# EAGLE design robot (EAGLE 9.1.3)
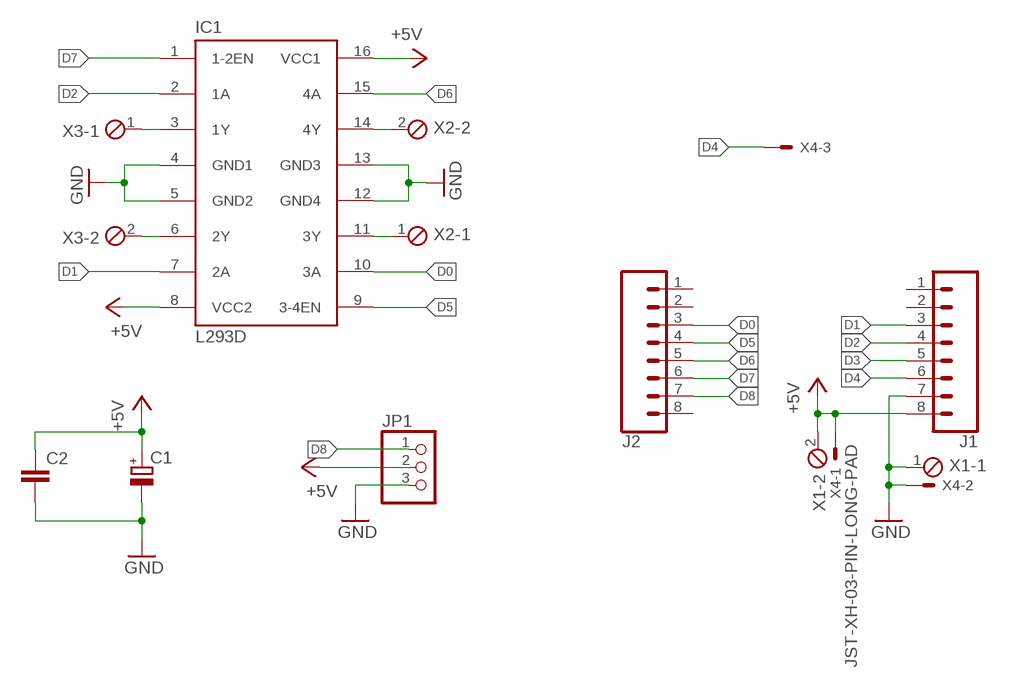
[diagram p0: schematic, sheet 1]

## Parts
C1  CPOL-EUE2.5-7  [E2,5-7]
C2  C-EUC0805K  [C0805K]
IC1  L293D  [DIL16]
J1  CONN_08"  [1X08]
J2  CONN_08"  [1X08]
JP1  PINHD-1X3  [1X03]
X1  MPT2  [2POL254]
X2  MPT2  [2POL254]
X3  MPT2  [2POL254]
X4  JST-XH-03-PIN-LONG-PAD  [JST-XH-03-PACKAGE-LONG-PAD]

## Nets
+5V: C1.+ C2.1 IC1.8(VCC2) IC1.16(VCC1) J1.8 JP1.2 X1.2 X4.1
D0: IC1.10(3A) J2.3
D1: IC1.7(2A) J1.3
D2: IC1.2(1A) J1.4
D3: J1.5
D4: J1.6 X4.3
D5: IC1.9(3-4EN) J2.4
D6: IC1.15(4A) J2.5
D7: IC1.1(1-2EN) J2.6
D8: J2.7 JP1.1
GND: C1.- C2.2 IC1.4(GND1) IC1.5(GND2) IC1.12(GND4) IC1.13(GND3) J1.7 JP1.3 X1.1 X4.2
N$1: IC1.3(1Y) X3.1
N$2: IC1.6(2Y) X3.2
N$3: IC1.11(3Y) X2.1
N$4: IC1.14(4Y) X2.2
Unconnected: J1.1 J1.2 J2.1 J2.2 J2.8

## Library data of the parts
C1 = rcl:CPOL-EU: POLARIZED CAPACITOR, European symbol
C2 = rcl:C-EU: CAPACITOR, European symbol
IC1 = st-microelectronics:L293D: PUSH-PULL 4 CHANNEL DRIVER; MPN: L293D; OC_FARNELL: 9589619; OC_NEWARK: 56P8249
J1 J2 = SparkFun-Connectors:CONN_08: Multi connection point. Often used as Generic Header-pin footprint for 0.1 inch spaced/style header connections On any of the 0.1 inch spaced packages, you can populate with these: Break Away Headers - Straight <https://www.sparkfun.com/products/116> (PRT-00116) Break Away Male Headers - Right Angle <https://www.sparkfun.com/products/553> (PRT-00553) Female Headers <https://www.sparkfun.com/products/115> (PRT-00115) Break Away Headers - Machine Pin <https://www.sparkfun.com/products/117> (PRT-00117) Break Away Female Headers - Swiss Machine Pin <https://www.sparkfun.com/products/743> (PRT-00743) Arduino Stackable Header - 8 Pin <https://www.sparkfun.com/products/9279> (PRT-09279) For SCREWTERMINALS and SPRING TERMINALS visit here: Screw Terimnals on SparkFun.com <https://www.sparkfun.com/search/results?term=Screw+Terminals> (5mm/3.5mm/2.54mm spacing) This device is also useful as a general connection point to wire up your design to another part of your project. Our various solder wires solder well into these plated through hole pads. Hook-Up Wire - Assortment (Stranded, 22 AWG) <https://www.sparkfun.com/products/11375> (PRT-11375) Hook-Up Wire - Assortment (Solid Core, 22 AWG) <https://www.sparkfun.com/products/11367> (PRT-11367) View the entire wire category on our website here <https://www.sparkfun.com/categories/141> Special notes: Molex polarized connector foot print use with SKU : PRT-08231 with associated crimp pins and housings. 1MM SMD Version SKU: PRT-10208 NOTES ON THE VARIANTS LOCK and LOCK_LONGPADS... This footprint was designed to help hold the alignment of a through-hole component (i.e. 6-pin header) while soldering it into place. You may notice that each hole has been shifted either up or down by 0.005 of an inch from it's more standard position (which is a perfectly straight line). This slight alteration caused the pins (the squares in the middle) to touch the edges of the holes. Because they are alternating, it causes a "brace" to hold the component in place. 0.005 has proven to be the perfect amount of "off-center" position when using our standard breakaway headers. Although looks a little odd when you look at the bare footprint, once you have a header in there, the alteration is very hard to notice. Also,if you push a header all the way into place, it is covered up entirely on the bottom side.; PROD_ID: CONN-08438
JP1 = pinhead:PINHD-1X3: PIN HEADER
X1-X3 = con-phoenix-254:MPT2: PHOENIX CONNECTOR; OC_FARNELL: unknown; OC_NEWARK: unknown
X4 = Rembrandt Electronics - JST XH Connectors v1-0:JST-XH-03-PIN: JST XH Connector 2 Pin Wire to board connector. Pitch: 2,54 mm, (0.100") Number of pins: 3 Created by Rembrandt Electronics www.rembrandtelectronics.com

## Board
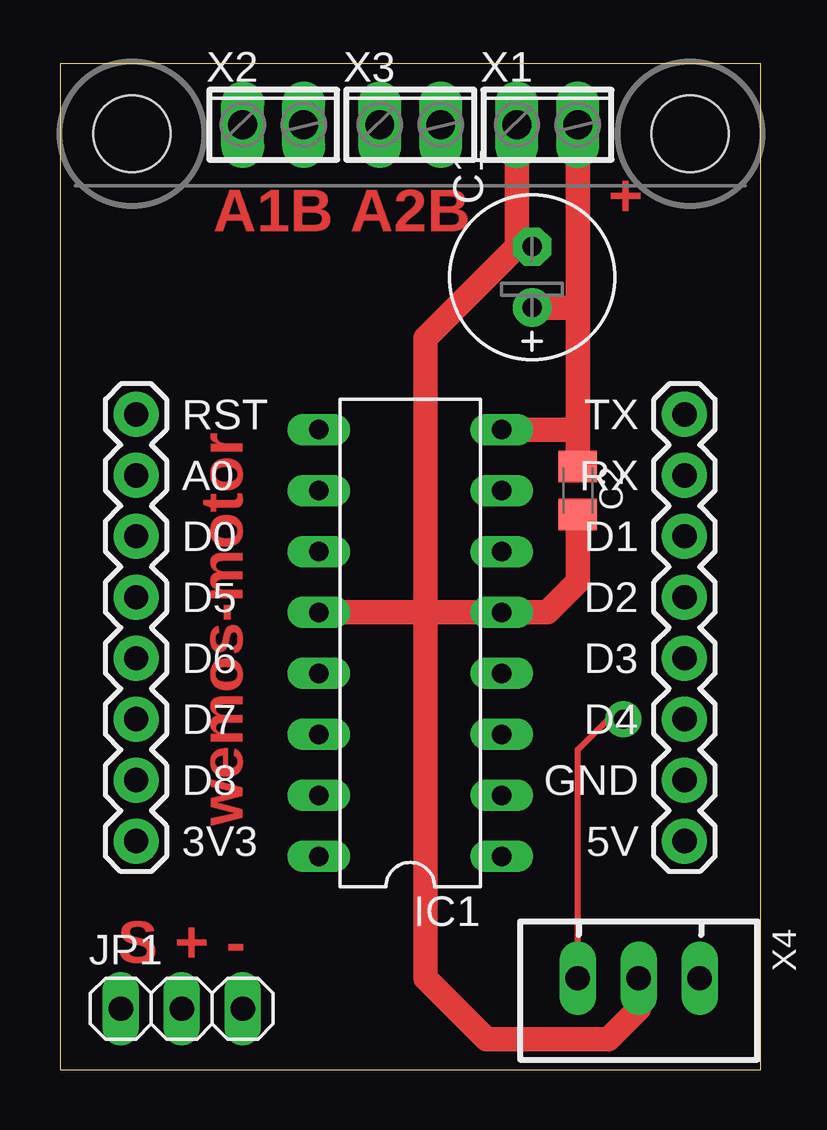
[diagram p1: board, top side]
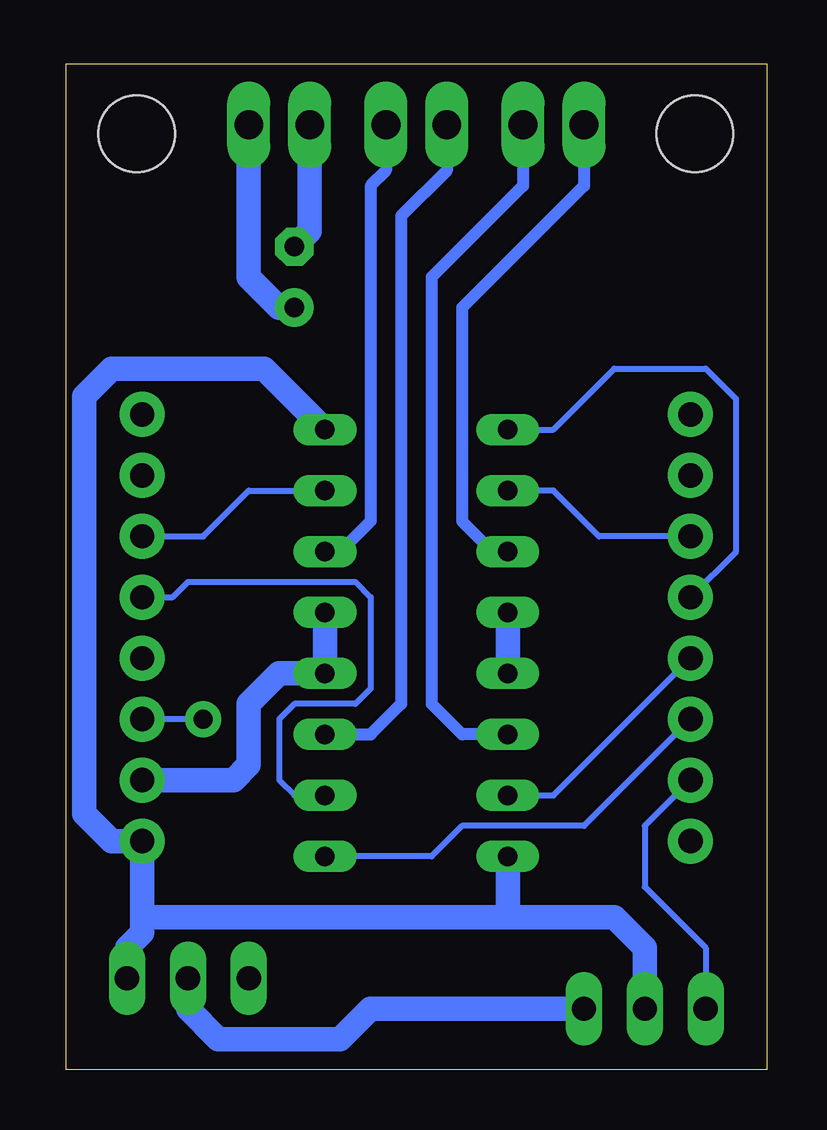
[diagram p2: board, bottom side, seen from below]

Size 29.21 x 41.91 mm. Coordinates in mm from the lower left corner, seen from the top.
Outline: 0,0 29.21,0 29.21,41.91 0,41.91 0,0
Copper layers (1*16): Top 0.035mm / dielectric 1.5mm / Bottom 0.035mm
Design rules "SeeedStudio_2layer_DRU_no_angle_20140221 *": minimum track width 10mil, minimum drill 0.5mm, track to track 10mil, track to pad 10mil, pad to pad 10mil, via to via 10mil, smd to smd 0mil, copper to edge 10mil, drill to drill 10mil, minimum pad ring 10mil, minimum via ring 6mil, stop-mask expansion 2mil, vias tented up to drill 100mil, thermal gap 10mil
Holes 3.2 mm at 3,39 26.27,39

### Footprints (pad centres in the part's own frame; a part is rotated, then mirrored left to right if it is on the bottom)
E2,5-7 = drill 0.813 pad 1.6: + -1.27,0 | drill 0.813 pad 1.6 octagon: - 1.27,0
C0805K = smd 1.3 x 1.6: 1 -1,0; 2 1,0
DIL16 = drill 0.813 long: 1 -8.89,-3.81; 2 -6.35,-3.81; 3 -3.81,-3.81; 4 -1.27,-3.81; 5 1.27,-3.81; 6 3.81,-3.81; 7 6.35,-3.81; 8 8.89,-3.81; 9 8.89,3.81; 10 6.35,3.81; 11 3.81,3.81; 12 1.27,3.81; 13 -1.27,3.81; 14 -3.81,3.81; 15 -6.35,3.81; 16 -8.89,3.81
1X08 = drill 1.016 pad 1.88: 1 0,0; 2 2.54,0; 3 5.08,0; 4 7.62,0; 5 10.16,0; 6 12.7,0; 7 15.24,0; 8 17.78,0
1X03 = drill 1.016 long: 1 -2.54,0; 2 0,0; 3 2.54,0
2POL254 = drill 1.2 long: 1 -1.27,0; 2 1.27,0
JST-XH-03-PACKAGE-LONG-PAD = drill 1.016 long: 1 -2.54,0; 2 0,0; 3 2.54,0

### Placement (x,y rotation side)
C1  19.68,33.02 90 top
C2  21.59,24.13 270 top
IC1  14.61,17.78 90 top
J1  26.04,27.3 270 top
J2  3.17,27.3 270 top
JP1  5.08,2.54 0 top
X1  20.32,39.37 0 top
X2  8.89,39.37 0 top
X3  14.61,39.37 0 top
X4  24.13,3.81 180 top

### Tracks (layer width: path | path; a pad name or v marks a point on that pad's centre or on a via)
+5V
  Top 1.016: IC1.8 21.59,26.67 | 21.59,26.67 21.59,31.75 | 21.59,31.75 X1.2 | C1.+ 21.59,31.75 | C2.1 21.59,26.67
  Bottom 1.016: IC1.8 20.95,29.21 27.3,29.21 28.45,28.07 28.45,10.67 27.3,9.53 J1.8 26.04,6.35 | IC1.16 10.79,6.99 10.79,6.35 | X4.1 26.67,5.08 26.04,5.71 26.04,6.35 | 10.79,6.35 26.04,6.35 | 10.79,6.35 6.35,6.35 5.08,5.08 JP1.2 | X1.2 21.59,33.02 20.32,31.75 C1.+
D0
  Bottom 0.254: IC1.10 8.89,24.13 6.99,22.23 J2.3
D1
  Bottom 0.254: IC1.7 21.59,24.13 23.5,22.23 J1.3
D2
  Bottom 0.254: J1.4 24.77,19.68 24.13,20.32 17.14,20.32 16.51,19.68 16.51,15.88 17.14,15.24 19.68,15.24 20.32,14.61 20.32,12.06 19.68,11.43 IC1.2
D4  (via drill 0.8 pad 1.5)
  Top 0.254: v23.5,14.61 22.86,14.61 21.59,13.34 X4.3
  Bottom 0.254: v23.5,14.61 J1.6
D5
  Bottom 0.254: J2.4 1.27,21.59 1.27,22.86 1.27,27.94 2.54,29.21 6.35,29.21 8.89,26.67 IC1.9
D6
  Bottom 0.254: IC1.15 8.89,11.43 J2.5
D7
  Bottom 0.254: J2.6 7.62,10.16 12.7,10.16 13.97,8.89 IC1.1
D8
  Bottom 0.254: J2.7 5.08,10.16 5.08,7.62 2.54,5.08 JP1.1
GND
  Top 1.016: IC1.12 15.24,19.05 | 15.24,19.05 IC1.5 20.32,19.05 21.59,20.32 C2.2 | 15.24,19.05 15.24,30.48 19.05,34.29 | X4.2 24.13,2.54 22.86,1.27 17.78,1.27 15.24,3.81 15.24,19.05 | X1.1 19.05,34.29 | C1.- 19.05,34.29
  Bottom 1.016: IC1.12 IC1.13 | IC1.5 IC1.4 20.32,16.51 21.59,15.24 21.59,12.7 22.23,12.06 J1.7 | X4.2 24.13,2.54 22.86,1.27 17.78,1.27 16.51,2.54 JP1.3 | C1.- 19.05,34.92 X1.1
N$1
  Bottom 0.508: IC1.3 16.51,13.97 15.24,15.24 15.24,35.56 13.34,37.47 X3.1
N$2
  Bottom 0.508: IC1.6 17.78,21.59 16.51,22.86 16.51,36.83 15.88,37.47 X3.2
N$3
  Bottom 0.508: IC1.11 11.43,21.59 12.7,22.86 12.7,31.75 7.62,36.83 X2.1
N$4
  Bottom 0.508: IC1.14 12.7,13.97 13.97,15.24 13.97,33.02 10.16,36.83 X2.2

### Text on the board
Top: + | A1B | A2B | wemos-motor | S + -
tPlace: RST | TX | A0 | RX | D0 | D1 | D5 | D2 | D6 | D3 | D7 | D4 | D8 | GND | 3V3 | 5V